# Altium schematic sheet ECG_BLE_radio.SchDoc
size A; SheetNumber: 3; SheetTotal: 5
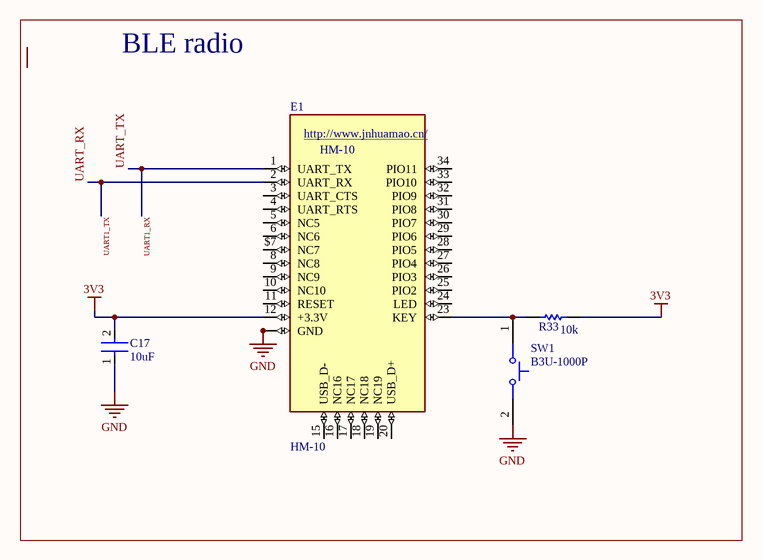
[diagram p0: ECG_BLE_radio.SchDoc]

## Parts
C17  10uF  [CAP-0805-IPC_B]
E1  HM-10  [HM-10]
R33  10k  [RES-0603-IPC_B]
SW1  B3U-1000P  [OMRON-B3U-1000_V]

## Blocks framed on the sheet
BLE radio: C17 E1 R33 SW1

## Nets
3V3: C17.2 E1.12(+3.3V) R33.2
GND: C17.1 E1.13(GND) E1.14(GND) E1.21(GND) E1.22(GND) SW1.2
UART1_RX: E1.1(UART_TX)  [also labelled UART_TX]
UART1_TX: E1.2(UART_RX)  [also labelled UART_RX]
NetE1_23: E1.23(KEY) R33.1 SW1.1

Not connected (* = marked no-connect by the designer): E1 3(UART_CTS) 4(UART_RTS) 5(NC5) 6(NC6) 8(NC8) 9(NC9) 10(NC10) 11(RESET) 15(USB_D-) 16(NC16) 17(NC17) 18(NC18) 19(NC19) 20(USB_D+) 24(LED) 25(PIO2) 26(PIO3) 27(PIO4) 28(PIO5) 29(PIO6) 30(PIO7) 31(PIO8) 32(PIO9) 33(PIO10) 34(PIO11) $7(NC7)

## Notes on the sheet
- (in symbol HM-10) http://www.jnhuamao.cn/

## Library data of the parts
C17 = 10uF CAP 0805 10V: 50V 10uF X5R 卤10% 0805 Multilayer Ceramic Capacitors MLCC - SMD/SMT ROHS; Manufacturer: Samsung Electro-Mechanics; Manufacturer Part Number: CL21A106KBYQNNE; Value: 10µF; Tolerance: 10%; Supplier: Mouser; Supplier Part Number: 187-CL21A106KBYQNNE; RoHS: Compliant; Category: Ceramic Capacitors; Stock: 130399; Pricing: 1=0.49, 10=0.221, 50=0.221, 100=0.197, 1000=0.146, 10000=0.123 (USD); Case/Package: 0805; China RoHS: Compliant; Dielectric Material: Ceramic; Height: 1.45mm; Lifecycle Status: Production; Material: Ceramic; Max Operating Temperature: 85°C; Min Operating Temperature: -55°C; Mounting Technology: Surface Mount; Number of Terminals: 2; REACH SVHC: Yes; Voltage Rating: 50V; Voltage Rating (DC): 50V; ComponentLink1URL: https://datasheet.octopart.com:443/CL21A106KBYQNNE-Samsung-Electro-Mechanics-datasheet-182022676.pdf?src-supplier=IHS; ComponentLink1Description: https://datasheet.octopart.com:443/CL21A106KBYQNNE-Samsung-Electro-Mechanics-datasheet-182022676.pdf?src-supplier=IHS; ComponentLink2URL: https://datasheet.octopart.com:443/CL21A106KBYQNNE-Samsung-Electro-Mechanics-datasheet-141347528.pdf?src-supplier=Samsung+SCT; ComponentLink2Description: https://datasheet.octopart.com:443/CL21A106KBYQNNE-Samsung-Electro-Mechanics-datasheet-141347528.pdf?src-supplier=Samsung+SCT; ComponentLink3URL: https://datasheet.octopart.com:443/CL21A106KBYQNNE-Samsung-Electro-Mechanics-datasheet-149154152.pdf?src-supplier=Future+Electronics; ComponentLink3Description: https://datasheet.octopart.com:443/CL21A106KBYQNNE-Samsung-Electro-Mechanics-datasheet-149154152.pdf?src-supplier=Future+Electronics
E1 = HM-10: Bluetooth 4.0 module with 4pin base board that can support iphone4s or later.; MF: Jinan Huamao Technology; SnapEDA_Link: https://www.snapeda.com/parts/HM-10/Jinan+Huamao+Technology/view-part/?ref=snap; Package: Package; Value: *; MP: HM-10; Check_prices: https://www.snapeda.com/parts/HM-10/Jinan+Huamao+Technology/view-part/?ref=eda
R33 = 1k RES-0603-IPC-B_1: Max Power Dissipation: 100mW; Temperature Coefficient: 50ppm/°C; Tolerance: 0.5%; Resistance: 4.7kR; Height: 0.022inch; Width: 0.032inch; RoHS Compliant: Yes; Features: Moisture Resistant; Packaging: Tape and Reel; Number of Terminations: 2; Max Operating Temperature: 155°C; Series: AT; Min Operating Temperature: -55°C; Resistor Type: Thin Film; Length: 0.063inch; Case/Package: 0603
SW1 = Tactile Switch: Tactile Switch, SPST-NO, 0.05 A, 12 V, -25 to 70 degC, 2-Pin SMD, RoHS, Tape and Reel; Manufacturer: Omron Electronic Components; IP Rating: IP40; Current Rating: 50mA; Max Contact Resistance: 100mohm; Operating Force: 153gf; Throw Configuration: SPST; Resistance: 0.1Ohm; Max Voltage Rating (DC): 12V; Contact Material: Silver; Max Current Rating: 50mA; Datasheet URL: http://www.omron.com/ecb/products/pdf/en-b3u.pdf; Mounting Technology: SM; Case/Package: B3U-1000; Packaging: TapeandReel; Package Reference: B3U-1000; Manufacturer URL: http://www.omron.com/; Datasheet Version: Jan-15; RoHS Compliant: True; Max Operating Temperature: 70°C; Contact Current Rating: 50mA; Package Quantity: 3500; Package Description: 2-Pin Surface Mount Device, Body 3 x 2.5 mm; Voltage Rating (DC): 12V; Min Operating Temperature: -25°C; Voltage Rating: 12V